# EAGLE schematic LED (EAGLE 7.1.0)
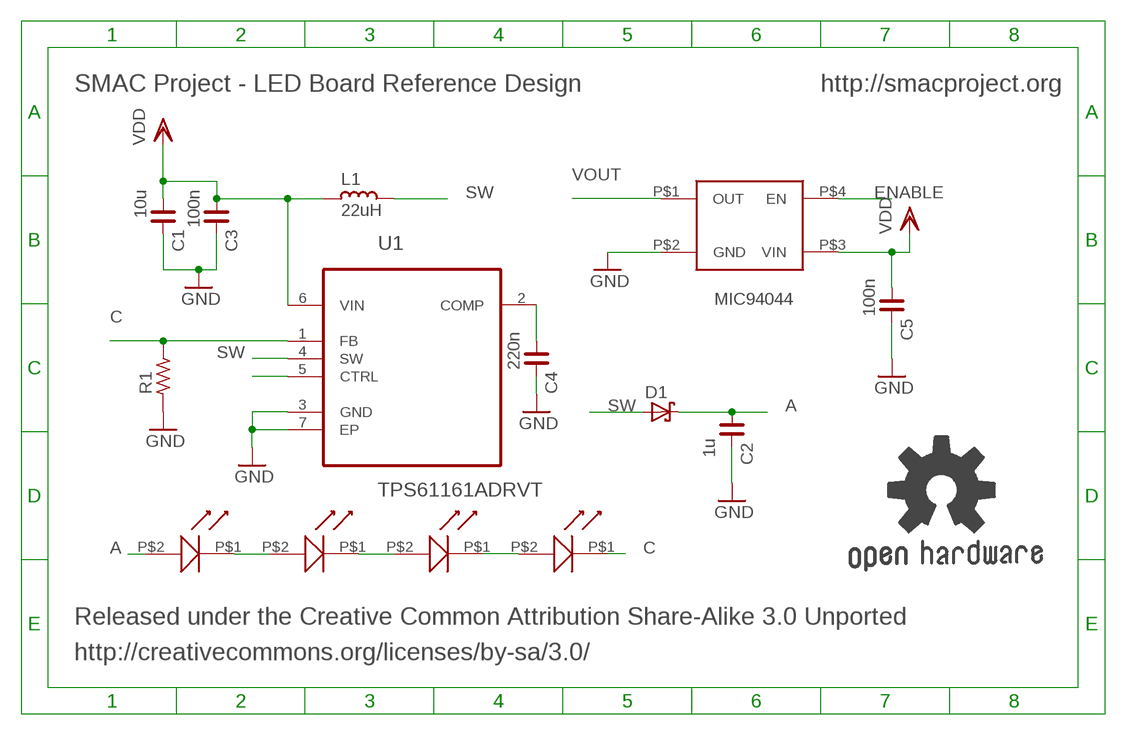
[diagram p0: schematic, sheet 1]

## Parts
C1  10u  C_0402  [C0402]
C2  1u  C_0402  [C0402]
C3  100n  C_0402  [C0402]
C4  220n  C_0402  [C0402]
C5  100n  C_0402  [C0402]
D1  SCHOTTKY-DIODE  [SOD123FL]
GOLD_ORB_SM2  OSHWLOGO_REF_SM  [OSHW2REF]
L1  22uH  L_0805  [L0805]
R1  R_0402  [R0402]
U1  TPS61161ADRVT  [SON65P200X200X80-7N]
U$1  LED_NICHIA  [LED_SMT_NICHIA]
U$2  LED_NICHIA  [LED_SMT_NICHIA]
U$3  LED_NICHIA  [LED_SMT_NICHIA]
U$4  LED_NICHIA  [LED_SMT_NICHIA]
U$5  MIC94044  [MIC94045YFL_FOOTPRINT]

## Nets
A: C2.1 D1.C U$4.P$2(A)
C: R1.2 U1.1(FB) U$2.P$1(K)
CTRL: U1.5(CTRL)
ENABLE: U$5.P$4(EN)
GND: C1.2 C2.2 C3.2 C4.2 C5.2 R1.1 U1.3(GND) U1.7(EP) U$5.P$2(GND)
N$1: U$2.P$2(A) U$3.P$1(K)
N$2: U$1.P$1(K) U$3.P$2(A)
N$3: U$1.P$2(A) U$4.P$1(K)
N$5: C4.1 U1.2(COMP)
SW: D1.A L1.1 U1.4(SW)
VDD: C1.1 C3.1 C5.1 L1.2 U1.6(VIN) U$5.P$3(VIN)
VOUT: U$5.P$1(OUT)

## Notes on the sheet
- SMAC Project - LED Board Reference Design | http://smacproject.org
- Released under the Creative Common Attribution Share-Alike 3.0 Unported
- http://creativecommons.org/licenses/by-sa/3.0/

## Library data of the parts
C1-C5 = rc-master-smd:C_: NON-POLARIZED CAP
D1 = diode:SCHOTTKY-DIODE: Schottky Diode
GOLD_ORB_SM2 = bfl:OSHWLOGO: These are Open-Source Hardware logos.
L1 = rc-master-smd:L_: INDUCTOR
R1 = rc-master-smd:R_: RESISTOR
U1 = TPS61161:TPS61161ADRVT: White LED Driver With PWM; MPN: TPS61161ADRVT; OC_FARNELL: 1735594; OC_NEWARK: 10R0471; PACKAGE: SON-6; SUPPLIER: Texas Instruments
U$1-U$4 = NS2L157AR:LED_NICHIA
U$5 = MIC94045YFL:MIC94044